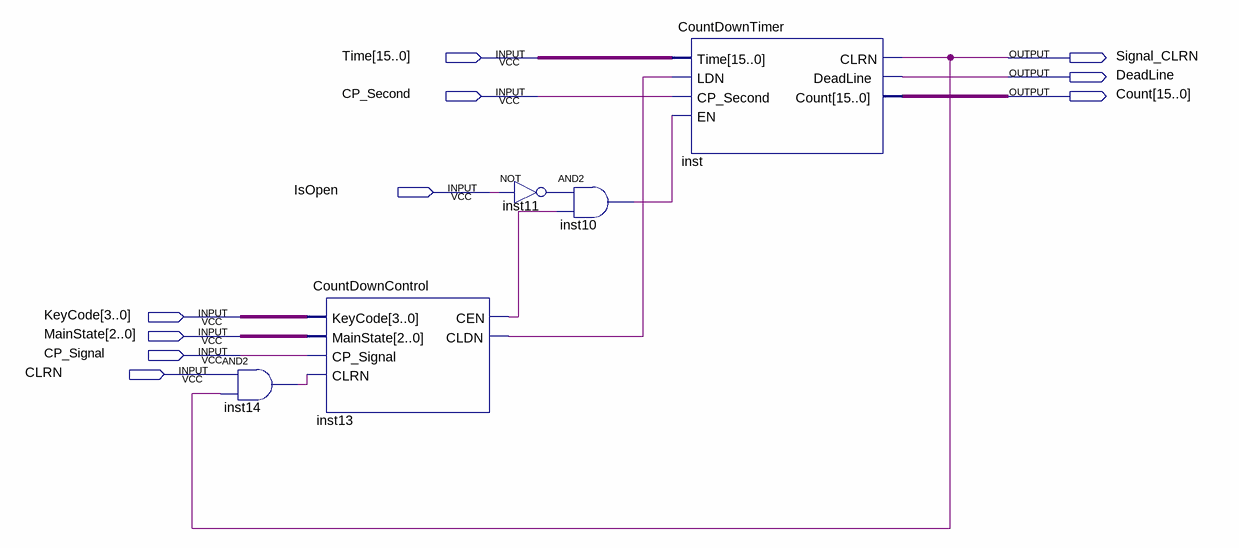
[diagram p0: schematic sheet]
// Quartus schematic CountDown_test.bdf as structural Verilog: 5 symbols, 10 pins
module CountDown_test (
  input  [15:0] Time,
  input  CP_Second,
  input  IsOpen,
  input  [3:0] KeyCode,
  input  [2:0] MainState,
  input  CP_Signal,
  input  CLRN,
  output Signal_CLRN,
  output DeadLine,
  output [15:0] Count
);

  wire inst10_out, inst11_out, inst13_cen, inst13_cldn, inst14_out;

  and inst14 (inst14_out, CLRN, Signal_CLRN);
  CountDownControl inst13 (
    .KeyCode(KeyCode), .MainState(MainState), .CP_Signal(CP_Signal), .CLRN(inst14_out), .CEN(inst13_cen),
    .CLDN(inst13_cldn));
  and inst10 (inst10_out, inst11_out, inst13_cen);
  not inst11 (inst11_out, IsOpen);
  CountDownTimer inst (
    .Time(Time), .LDN(inst13_cldn), .CP_Second(CP_Second), .EN(inst10_out), .CLRN(Signal_CLRN),
    .DeadLine(DeadLine), .Count(Count));
endmodule
